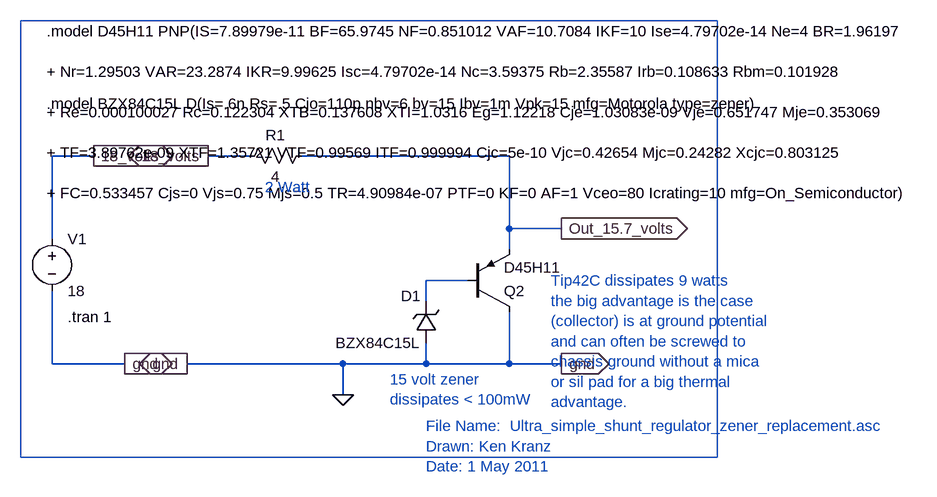
[diagram p0: schematic P6_Ultra_simple_Shunt_regulator_zener_replacement.asc]
P6_Ultra_simple_Shunt_regulator_zener_replacement.asc, the LTspice schematic file:
Version 4
SHEET 1 880 680
WIRE -704 -192 -768 -192
WIRE -464 -192 -528 -192
WIRE -64 -192 -384 -192
WIRE -64 -80 -64 -192
WIRE 16 -80 -64 -80
WIRE -768 -64 -768 -192
WIRE -64 -48 -64 -80
WIRE -128 0 -192 0
WIRE -192 32 -192 0
WIRE -768 128 -768 16
WIRE -656 128 -768 128
WIRE -320 128 -560 128
WIRE -192 128 -192 96
WIRE -192 128 -320 128
WIRE -64 128 -64 48
WIRE -64 128 -192 128
WIRE 16 128 -64 128
WIRE -320 176 -320 128
FLAG -320 176 0
FLAG -704 -192 18_volts
IOPIN -704 -192 Out
FLAG -656 128 gnd
IOPIN -656 128 Out
FLAG -528 -192 18_volts
IOPIN -528 -192 Out
FLAG -560 128 gnd
IOPIN -560 128 Out
FLAG 16 -80 Out_15.7_volts
IOPIN 16 -80 Out
FLAG 16 128 gnd
IOPIN 16 128 Out
SYMBOL zener -176 96 R180
WINDOW 0 24 72 Left 0
WINDOW 3 24 0 Left 0
SYMATTR InstName D1
SYMATTR Value BZX84C15L
SYMATTR Description Diode
SYMATTR Type diode
SYMBOL res -368 -208 R90
WINDOW 0 0 56 VBottom 0
WINDOW 3 32 56 VTop 0
SYMATTR InstName R1
SYMATTR Value 4
SYMBOL voltage -768 -80 R0
WINDOW 123 0 0 Left 0
WINDOW 39 0 0 Left 0
SYMATTR InstName V1
SYMATTR Value 18
SYMBOL pnp -128 48 M180
SYMATTR InstName Q2
SYMATTR Value D45H11
TEXT -192 224 Left 0 ;File Name:  Ultra_simple_shunt_regulator_zener_replacement.asc\nDrawn: Ken Kranz\nDate: 1 May 2011
TEXT -744 56 Left 0 !.tran 1
TEXT -776 -384 Left 0 !.model D45H11 PNP(IS=7.89979e-11 BF=65.9745 NF=0.851012 VAF=10.7084 IKF=10 Ise=4.79702e-14 Ne=4 BR=1.96197\n\n+ Nr=1.29503 VAR=23.2874 IKR=9.99625 Isc=4.79702e-14 Nc=3.59375 Rb=2.35587 Irb=0.108633 Rbm=0.101928\n\n+ Re=0.000100027 Rc=0.122304 XTB=0.137608 XTI=1.0316 Eg=1.12218 Cje=1.03083e-09 Vje=0.651747 Mje=0.353069\n\n+ TF=3.89762e-09 XTF=1.35721 VTF=0.99569 ITF=0.999994 Cjc=5e-10 Vjc=0.42654 Mjc=0.24282 Xcjc=0.803125\n\n+ FC=0.533457 Cjs=0 Vjs=0.75 Mjs=0.5 TR=4.90984e-07 PTF=0 KF=0 AF=1 Vceo=80 Icrating=10 mfg=On_Semiconductor)
TEXT -440 -144 Left 0 ;2 Watt
TEXT -248 152 Left 0 ;15 volt zener\ndissipates < 100mW
TEXT -776 -272 Left 0 !.model BZX84C15L D(Is=.6n Rs=.5 Cjo=110p nbv=6 bv=15 Ibv=1m Vpk=15 mfg=Motorola type=zener)
TEXT 0 0 Left 0 ;Tip42C dissipates 9 watts\nthe big advantage is the case\n(collector) is at ground potential\nand can often be screwed to \nchassis ground without a mica\nor sil pad for a big thermal\nadvantage.
RECTANGLE Normal 256 272 -816 -400

The netlist it stands for:
* P6_Ultra_simple_Shunt_regulator_zener_replacement.asc
D1 0 N001 BZX84C15L
R1 Out_15.7_volts 18_volts 4
V1 18_volts 0 18
Q2 0 N001 Out_15.7_volts 0 D45H11
.model D D
.lib standard.dio
.model NPN NPN
.model PNP PNP
.lib standard.bjt
* File Name:  Ultra_simple_shunt_regulator_zener_replacement.asc
* Drawn: Ken Kranz
* Date: 1 May 2011
.tran 1
.model D45H11 PNP(IS=7.89979e-11 BF=65.9745 NF=0.851012 VAF=10.7084 IKF=10 Ise=4.79702e-14 Ne=4 BR=1.96197
+ Nr=1.29503 VAR=23.2874 IKR=9.99625 Isc=4.79702e-14 Nc=3.59375 Rb=2.35587 Irb=0.108633 Rbm=0.101928
+ Re=0.000100027 Rc=0.122304 XTB=0.137608 XTI=1.0316 Eg=1.12218 Cje=1.03083e-09 Vje=0.651747 Mje=0.353069
+ TF=3.89762e-09 XTF=1.35721 VTF=0.99569 ITF=0.999994 Cjc=5e-10 Vjc=0.42654 Mjc=0.24282 Xcjc=0.803125
+ FC=0.533457 Cjs=0 Vjs=0.75 Mjs=0.5 TR=4.90984e-07 PTF=0 KF=0 AF=1 Vceo=80 Icrating=10 mfg=On_Semiconductor)
* 2 Watt
* 15 volt zener
* dissipates < 100mW
.model BZX84C15L D(Is=.6n Rs=.5 Cjo=110p nbv=6 bv=15 Ibv=1m Vpk=15 mfg=Motorola type=zener)
* Tip42C dissipates 9 watts
* the big advantage is the case
* (collector) is at ground potential
* and can often be screwed to
* chassis ground without a mica
* or sil pad for a big thermal
* advantage.
.backanno
.end